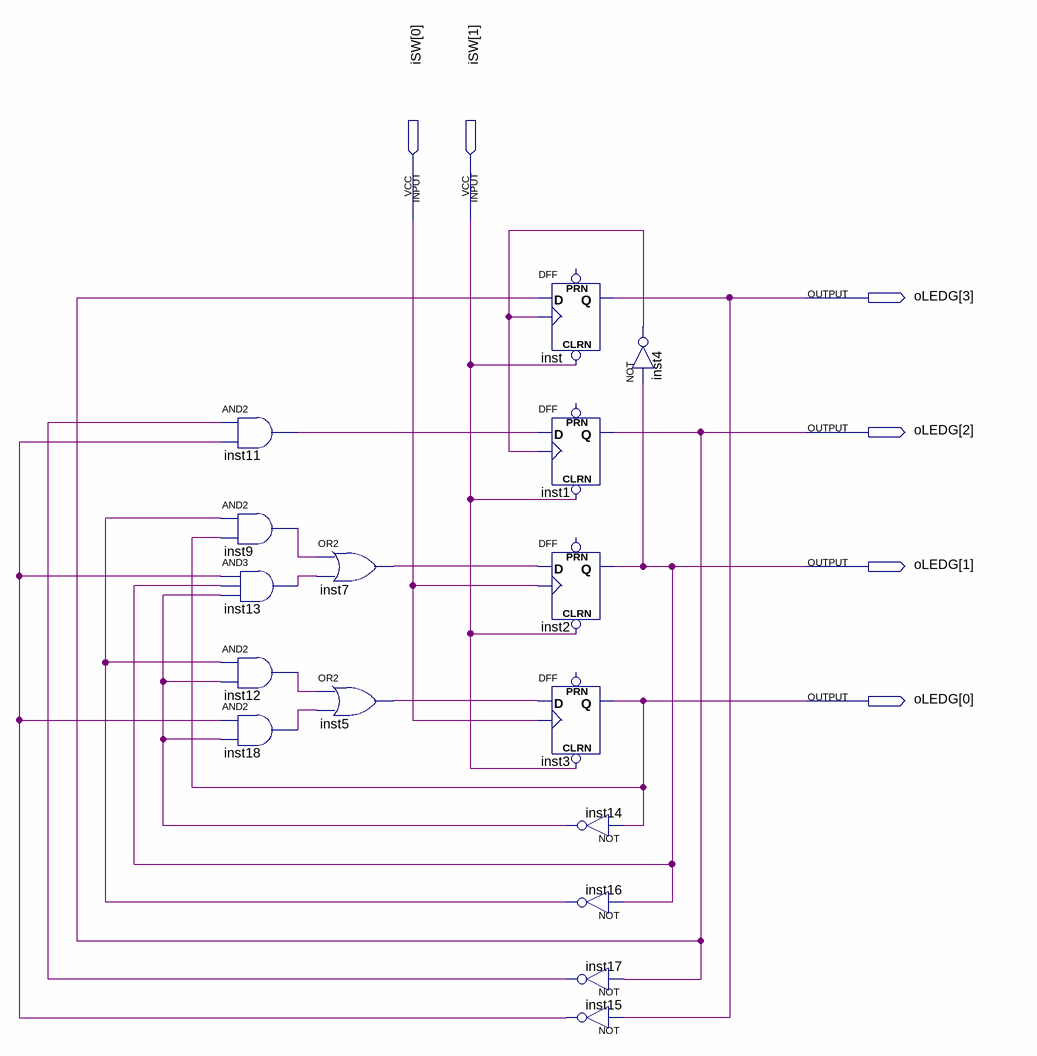
[diagram p0: schematic sheet]
// Quartus schematic Cwiczenie2_3.bdf as structural Verilog: 16 symbols, 6 pins
module Cwiczenie2_3 (
  input  [1:0] iSW,
  output [3:0] oLEDG
);

  wire inst4_out, inst5_out, inst7_out, inst9_out, inst11_out, inst12_out, inst13_out, inst14_out,
       inst15_out, inst16_out, inst17_out, inst18_out;

  and inst11 (inst11_out, inst17_out, inst15_out);
  and inst9 (inst9_out, inst16_out, oLEDG[0]);
  and inst13 (inst13_out, inst15_out, oLEDG[1], inst14_out);
  and inst12 (inst12_out, inst16_out, inst14_out);
  and inst18 (inst18_out, inst15_out, inst14_out);
  or inst7 (inst7_out, inst9_out, inst13_out);
  or inst5 (inst5_out, inst12_out, inst18_out);
  DFF inst (.CLRN(iSW[1]), .CLK(inst4_out), .D(oLEDG[2]), .Q(oLEDG[3]));  // open: PRN
  DFF inst1 (.CLRN(iSW[1]), .CLK(inst4_out), .D(inst11_out), .Q(oLEDG[2]));  // open: PRN
  DFF inst2 (.CLRN(iSW[1]), .CLK(iSW[0]), .D(inst7_out), .Q(oLEDG[1]));  // open: PRN
  DFF inst3 (.CLRN(iSW[1]), .CLK(iSW[0]), .D(inst5_out), .Q(oLEDG[0]));  // open: PRN
  not inst4 (inst4_out, oLEDG[1]);
  not inst14 (inst14_out, oLEDG[0]);
  not inst16 (inst16_out, oLEDG[1]);
  not inst17 (inst17_out, oLEDG[2]);
  not inst15 (inst15_out, oLEDG[3]);
endmodule
